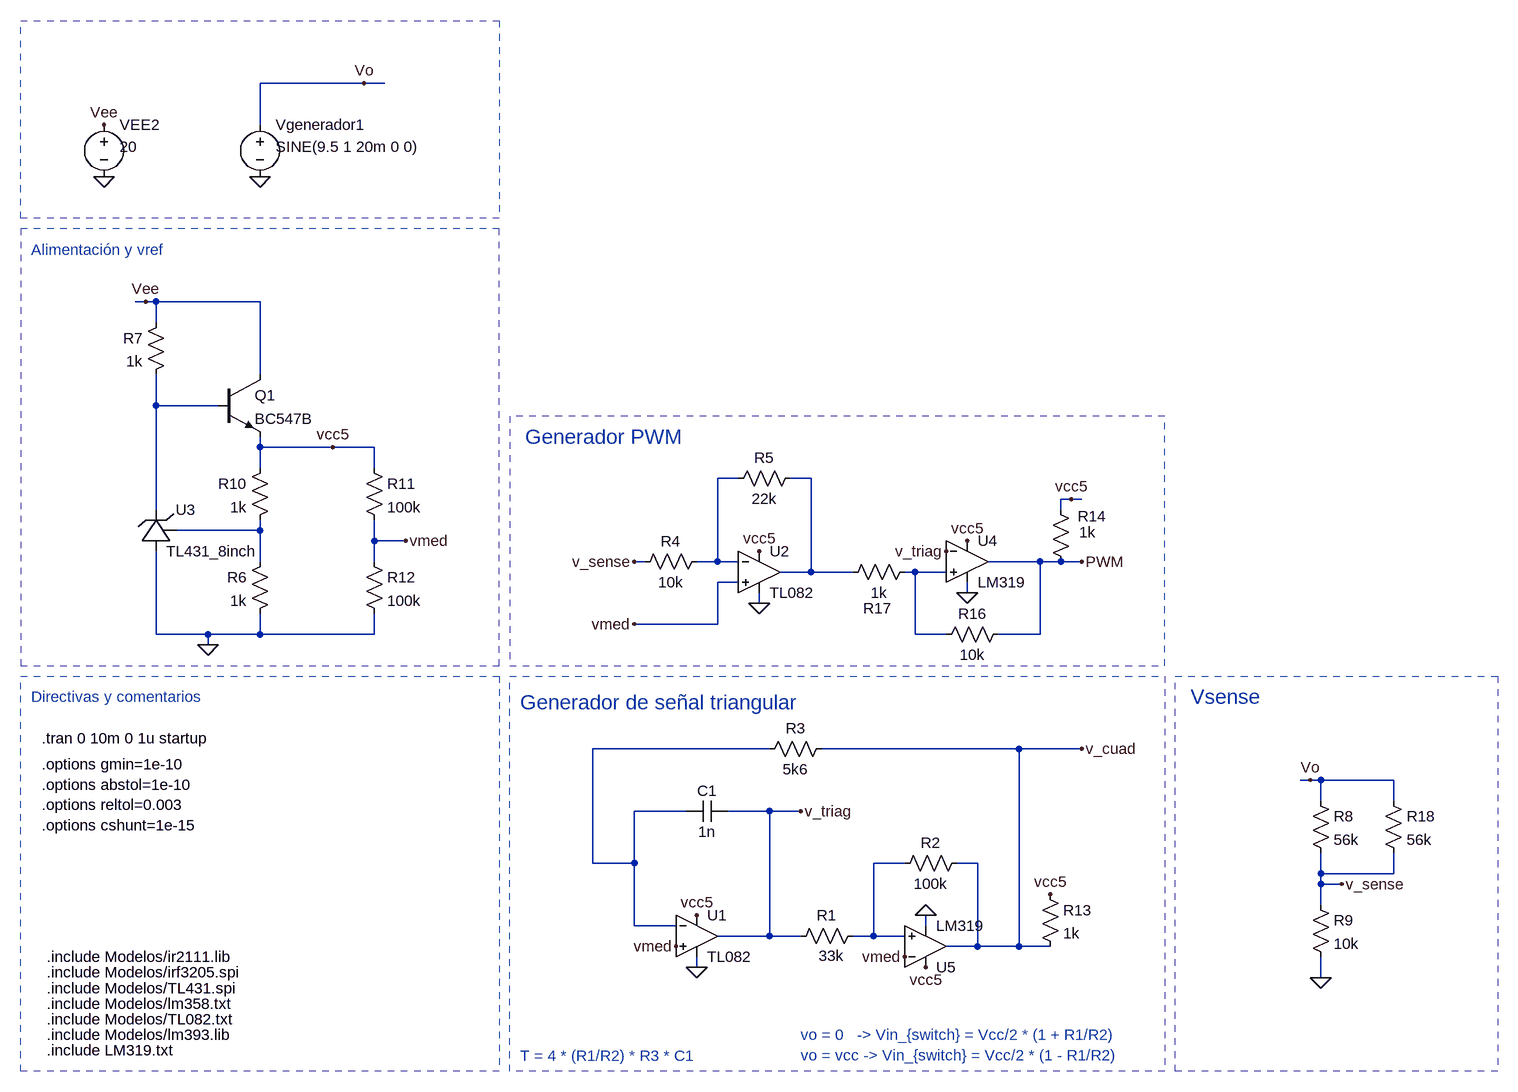
[diagram p0: schematic CircuitoCompleteo_buck_pwm.asc]
CircuitoCompleteo_buck_pwm.asc, the LTspice schematic file:
Version 4.1
SHEET 1 3716 1864
WIRE -2656 -1088 -2816 -1088
WIRE -2624 -1088 -2656 -1088
WIRE -2816 -1024 -2816 -1088
WIRE -2992 -752 -3008 -752
WIRE -2976 -752 -2992 -752
WIRE -2816 -752 -2976 -752
WIRE -2976 -720 -2976 -752
WIRE -2816 -640 -2816 -752
WIRE -2976 -592 -2976 -640
WIRE -2880 -592 -2976 -592
WIRE -2816 -528 -2816 -544
WIRE -2704 -528 -2816 -528
WIRE -2640 -528 -2704 -528
WIRE -2816 -496 -2816 -528
WIRE -2640 -496 -2640 -528
WIRE -2080 -480 -2112 -480
WIRE -1968 -480 -2000 -480
WIRE -1568 -448 -1584 -448
WIRE -1552 -448 -1568 -448
WIRE -2976 -432 -2976 -592
WIRE -1584 -432 -1584 -448
WIRE -2816 -400 -2816 -416
WIRE -2816 -400 -2944 -400
WIRE -2640 -384 -2640 -416
WIRE -2592 -384 -2640 -384
WIRE -2816 -352 -2816 -400
WIRE -2640 -352 -2640 -384
WIRE -2224 -352 -2240 -352
WIRE -2112 -352 -2112 -480
WIRE -2112 -352 -2144 -352
WIRE -2080 -352 -2112 -352
WIRE -1616 -352 -1696 -352
WIRE -1584 -352 -1616 -352
WIRE -1552 -352 -1584 -352
WIRE -1968 -336 -1968 -480
WIRE -1968 -336 -2016 -336
WIRE -1904 -336 -1968 -336
WIRE -1808 -336 -1824 -336
WIRE -1760 -336 -1808 -336
WIRE -2080 -320 -2112 -320
WIRE -1728 -304 -1728 -320
WIRE -2048 -288 -2048 -304
WIRE -2112 -256 -2112 -320
WIRE -2112 -256 -2240 -256
WIRE -2976 -240 -2976 -368
WIRE -2896 -240 -2976 -240
WIRE -2816 -240 -2816 -272
WIRE -2816 -240 -2896 -240
WIRE -2640 -240 -2640 -272
WIRE -2640 -240 -2816 -240
WIRE -1808 -240 -1808 -336
WIRE -1760 -240 -1808 -240
WIRE -1616 -240 -1616 -352
WIRE -1616 -240 -1680 -240
WIRE -2896 -224 -2896 -240
WIRE -2032 -64 -2304 -64
WIRE -1648 -64 -1952 -64
WIRE -1552 -64 -1648 -64
WIRE -1200 -16 -1216 -16
WIRE -1184 -16 -1200 -16
WIRE -1072 -16 -1184 -16
WIRE -1184 16 -1184 -16
WIRE -1072 16 -1072 -16
WIRE -2160 32 -2240 32
WIRE -2032 32 -2096 32
WIRE -1984 32 -2032 32
WIRE -2304 112 -2304 -64
WIRE -2240 112 -2240 32
WIRE -2240 112 -2304 112
WIRE -1824 112 -1872 112
WIRE -1712 112 -1744 112
WIRE -1184 128 -1184 96
WIRE -1072 128 -1072 96
WIRE -1072 128 -1184 128
WIRE -1184 144 -1184 128
WIRE -1152 144 -1184 144
WIRE -1184 176 -1184 144
WIRE -2240 208 -2240 112
WIRE -2176 208 -2240 208
WIRE -1792 208 -1792 192
WIRE -2032 224 -2032 32
WIRE -2032 224 -2112 224
WIRE -1984 224 -2032 224
WIRE -1872 224 -1872 112
WIRE -1872 224 -1904 224
WIRE -1824 224 -1872 224
WIRE -1712 240 -1712 112
WIRE -1712 240 -1760 240
WIRE -1648 240 -1648 -64
WIRE -1648 240 -1712 240
WIRE -1600 240 -1648 240
WIRE -2144 272 -2144 256
WIRE -1184 288 -1184 256
FLAG -1792 192 0
FLAG -1552 -64 v_cuad
FLAG -2144 272 0
FLAG -1984 32 v_triag
FLAG -2176 240 vmed
FLAG -1824 256 vmed
FLAG -2048 -288 0
FLAG -2896 -224 0
FLAG -2992 -752 Vee
FLAG -2704 -528 vcc5
FLAG -1728 -304 0
FLAG -1760 -368 v_triag
FLAG -1184 288 0
FLAG -1152 144 v_sense
FLAG -2240 -352 v_sense
FLAG -2592 -384 vmed
FLAG -1792 272 vcc5
FLAG -2144 192 vcc5
FLAG -2048 -368 vcc5
FLAG -1728 -384 vcc5
FLAG -2240 -256 vmed
FLAG -1600 160 vcc5
FLAG -1568 -448 vcc5
FLAG -1200 -16 Vo
FLAG -1552 -352 PWM
FLAG -2816 -944 0
FLAG -2656 -1088 Vo
FLAG -3056 -944 0
FLAG -3056 -1024 Vee
SYMBOL res -1888 208 R90
WINDOW 0 0 56 VBottom 2
WINDOW 3 31 49 VTop 2
SYMATTR InstName R1
SYMATTR Value 33k
SYMBOL res -1728 96 R90
WINDOW 0 0 56 VBottom 2
WINDOW 3 32 56 VTop 2
SYMATTR InstName R2
SYMATTR Value 100k
SYMBOL cap -2096 16 R90
WINDOW 0 0 32 VBottom 2
WINDOW 3 32 32 VTop 2
SYMATTR InstName C1
SYMATTR Value 1n
SYMBOL OpAmps\\opamp2 -2144 160 R0
SYMATTR InstName U1
SYMATTR Value TL082
SYMBOL res -1936 -80 R90
WINDOW 0 0 56 VBottom 2
WINDOW 3 32 56 VTop 2
SYMATTR InstName R3
SYMATTR Value 5k6
SYMBOL OpAmps\\opamp2 -2048 -400 R0
SYMATTR InstName U2
SYMATTR Value TL082
SYMBOL res -2128 -368 R90
WINDOW 0 0 56 VBottom 2
WINDOW 3 32 56 VTop 2
SYMATTR InstName R4
SYMATTR Value 10k
SYMBOL res -1984 -496 R90
WINDOW 0 0 56 VBottom 2
WINDOW 3 32 56 VTop 2
SYMATTR InstName R5
SYMATTR Value 22k
SYMBOL res -2800 -368 M0
SYMATTR InstName R6
SYMATTR Value 1k
SYMBOL res -2960 -736 M0
SYMATTR InstName R7
SYMATTR Value 1k
SYMBOL res -1200 0 R0
SYMATTR InstName R8
SYMATTR Value 56k
SYMBOL res -1200 160 R0
SYMATTR InstName R9
SYMATTR Value 10k
SYMBOL Modelos\\TL431 -2976 -400 R0
SYMATTR InstName U3
SYMBOL res -2800 -512 M0
SYMATTR InstName R10
SYMATTR Value 1k
SYMBOL npn -2880 -640 R0
SYMATTR InstName Q1
SYMATTR Value BC547B
SYMBOL res -2656 -512 R0
SYMATTR InstName R11
SYMATTR Value 100k
SYMBOL res -2656 -368 R0
SYMATTR InstName R12
SYMATTR Value 100k
SYMBOL OpAmps\\opamp2 -1728 -416 R0
SYMATTR InstName U4
SYMATTR Value LM319
SYMBOL OpAmps\\opamp2 -1792 304 M180
SYMATTR InstName U5
SYMATTR Value LM319
SYMBOL res -1616 144 R0
SYMATTR InstName R13
SYMATTR Value 1k
SYMBOL res -1600 -448 R0
WINDOW 0 42 26 Left 2
WINDOW 3 44 51 Left 2
SYMATTR InstName R14
SYMATTR Value 1k
SYMBOL voltage -2816 -1040 R0
WINDOW 3 24 50 Left 2
WINDOW 123 0 0 Left 0
WINDOW 39 0 0 Left 0
SYMATTR Value SINE(9.5 1 20m 0 0)
SYMATTR InstName Vgenerador1
SYMBOL res -1664 -256 R90
WINDOW 0 0 56 VBottom 2
WINDOW 3 32 56 VTop 2
SYMATTR InstName R16
SYMATTR Value 10k
SYMBOL res -1808 -352 R90
WINDOW 0 87 58 VBottom 2
WINDOW 3 32 56 VTop 2
SYMATTR InstName R17
SYMATTR Value 1k
SYMBOL res -1088 0 R0
SYMATTR InstName R18
SYMATTR Value 56k
SYMBOL voltage -3056 -1040 R0
WINDOW 3 24 50 Left 2
WINDOW 123 0 0 Left 0
WINDOW 39 0 0 Left 0
SYMATTR Value 20
SYMATTR InstName VEE2
TEXT -3144 376 Left 2 !.include Modelos/lm393.lib
TEXT -3152 -80 Left 2 !.tran 0 10m 0 1u startup
TEXT -1984 376 Left 2 ;vo = 0   -> Vin_{switch} = Vcc/2 * (1 + R1/R2)\nvo = vcc -> Vin_{switch} = Vcc/2 * (1 - R1/R2)
TEXT -3144 352 Left 2 !.include Modelos/TL082.txt
TEXT -3144 328 Left 2 !.include Modelos/lm358.txt
TEXT -3152 -40 Left 2 !.options gmin=1e-10\n.options abstol=1e-10\n.options reltol=0.003\n.options cshunt=1e-15
TEXT -3144 304 Left 2 !.include Modelos/TL431.spi
TEXT -3168 -144 Left 2 ;Directivas y comentarios
TEXT -2416 -136 Left 3 ;Generador de señal triangular
TEXT -2416 408 Left 2 ;T = 4 * (R1/R2) * R3 * C1
TEXT -3168 -832 Left 2 ;Alimentación y vref
TEXT -2408 -544 Left 3 ;Generador PWM
TEXT -1384 -144 Left 3 ;Vsense
TEXT -3144 400 Left 2 !.include LM319.txt
TEXT -3144 280 Left 2 !.include Modelos/irf3205.spi
TEXT -3144 256 Left 2 !.include Modelos/ir2111.lib
RECTANGLE Normal -1424 432 -2432 -176 3
RECTANGLE Normal -3184 -176 -2448 432 3
RECTANGLE Normal -2448 -864 -3184 -192 3
RECTANGLE Normal -1424 -576 -2432 -192 3
RECTANGLE Normal -912 432 -1408 -176 3
RECTANGLE Normal -3184 -1184 -2448 -880 3

The netlist it stands for:
* CircuitoCompleteo_buck_pwm.asc
R1 N007 v_triag 33k
R2 v_cuad N007 100k
C1 v_triag N006 1n
X§U1 vmed N006 vcc5 0 v_triag TL082  ; pins In+ In- V+ V- OUT
R3 v_cuad N006 5k6
X§U2 vmed N002 vcc5 0 N003 TL082  ; pins In+ In- V+ V- OUT
R4 N002 v_sense 10k
R5 N003 N002 22k
R6 N004 0 1k
R7 Vee N001 1k
R8 Vo v_sense 56k
R9 v_sense 0 10k
X§U3 N001 0 N004 TL431_8inch  ; pins VCC VEE ADJ
R10 vcc5 N004 1k
Q1 Vee N001 vcc5 0 BC547B
R11 vcc5 vmed 100k
R12 vmed 0 100k
X§U4 N005 v_triag vcc5 0 PWM LM319  ; pins In+ In- V+ V- OUT
X§U5 N007 vmed vcc5 0 v_cuad LM319  ; pins In+ In- V+ V- OUT
R13 vcc5 v_cuad 1k
R14 vcc5 PWM 1k
Vgenerador1 Vo 0 SINE(9.5 1 20m 0 0)
R16 PWM N005 10k
R17 N005 N003 1k
R18 Vo v_sense 56k
VEE2 Vee 0 20
.model NPN NPN
.model PNP PNP
.lib standard.bjt
.include Modelos/lm393.lib
.tran 0 10m 0 1u startup
* vo = 0   -> Vin_{switch} = Vcc/2 * (1 + R1/R2)
* vo = vcc -> Vin_{switch} = Vcc/2 * (1 - R1/R2)
.include Modelos/TL082.txt
.include Modelos/lm358.txt
.options gmin=1e-10
.options abstol=1e-10
.options reltol=0.003
.options cshunt=1e-15
.include Modelos/TL431.spi
* Directivas y comentarios
* Generador de señal triangular
* T = 4 * (R1/R2) * R3 * C1
* Alimentación y vref
* Generador PWM
* Vsense
.include LM319.txt
.include Modelos/irf3205.spi
.include Modelos/ir2111.lib
.backanno
.end